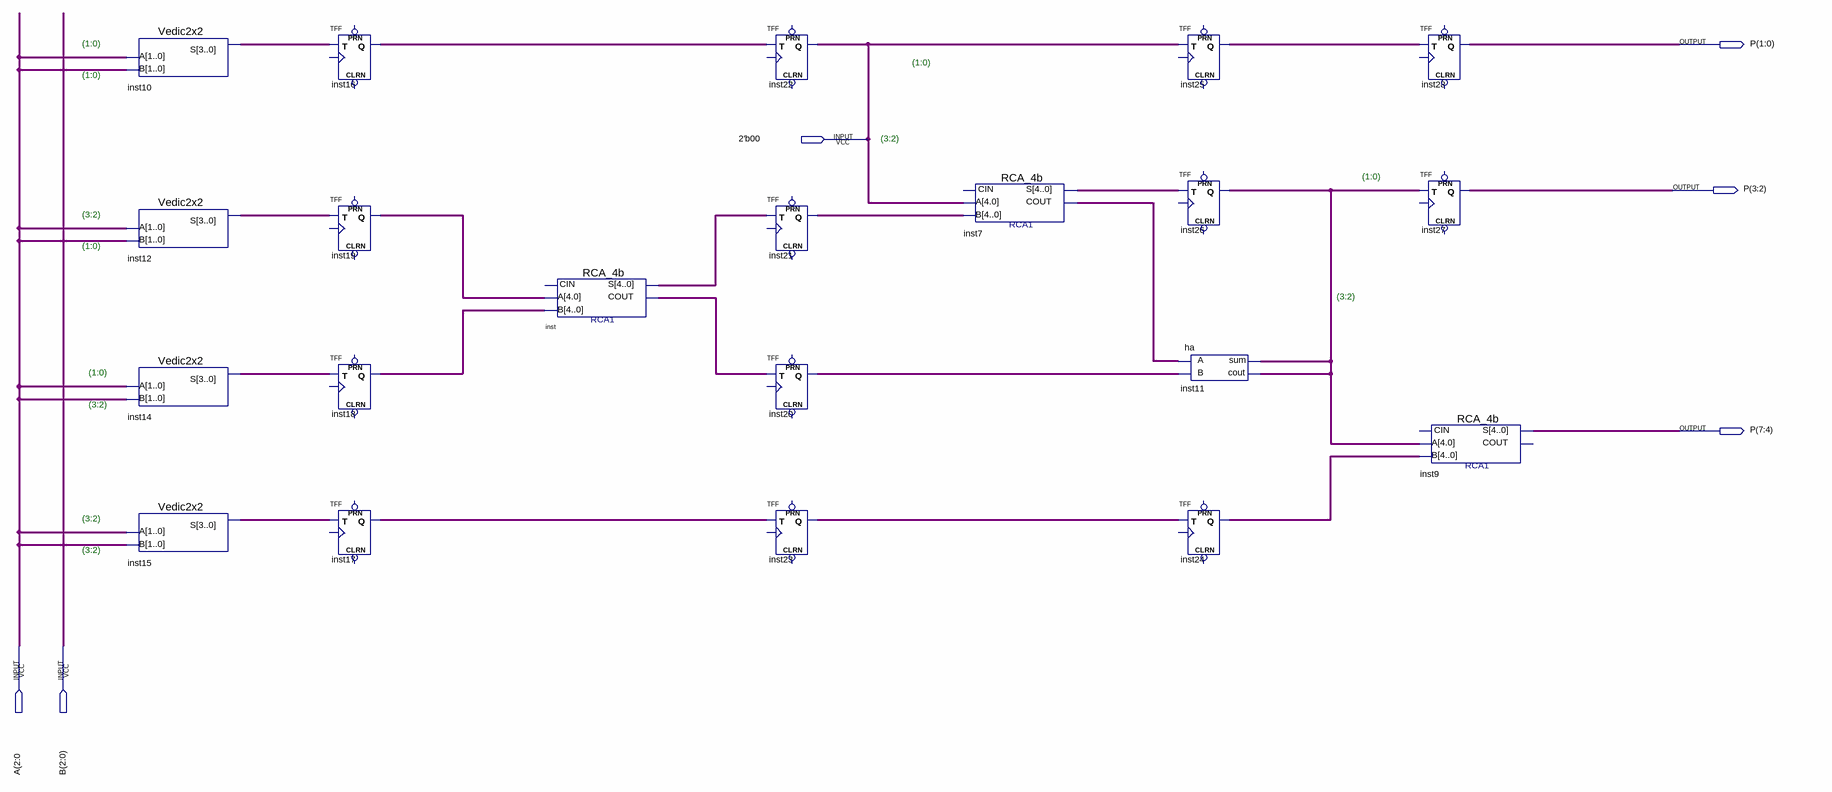
[diagram p0: schematic sheet]
// Quartus schematic shematic_4x4.bdf as structural Verilog: 21 symbols, 6 pins
module shematic_4x4 (
  input  \2'b00 ,
  input  \A(2:0 ,
  input  \B(2:0) ,
  output \P(1:0) ,
  output \P(3:2) ,
  output \P(7:4) 
);

  wire inst7_cout, inst20_q, inst_cout;
  wire [1:0] undriven;
  wire [3:0] inst10_sum, inst12_sum, inst16_q, inst19_q, inst22_q, inst25_q, inst28_q;
  wire [4:0] inst14_sum, inst15_sum, inst17_q, inst18_q, inst23_q, inst24_q;
  wire [7:0] inst7_sum, inst9_sum, inst21_q, inst26_q, inst27_q, inst_sum;

  Vedic2x2 inst10 (.A(undriven), .B(undriven), .SUM(inst10_sum));
  Vedic2x2 inst12 (.A(undriven), .B(undriven), .SUM(inst12_sum));
  Vedic2x2 inst14 (.A(undriven), .B(undriven), .SUM(inst14_sum));
  Vedic2x2 inst15 (.A(undriven), .B(undriven), .SUM(inst15_sum));
  TFF inst16[3:0] (.T(inst10_sum), .Q(inst16_q));  // open: PRN, CLRN, CLK
  TFF inst19[3:0] (.T(inst12_sum), .Q(inst19_q));  // open: PRN, CLRN, CLK
  TFF inst18[4:0] (.T(inst14_sum), .Q(inst18_q));  // open: PRN, CLRN, CLK
  TFF inst17[4:0] (.T(inst15_sum), .Q(inst17_q));  // open: PRN, CLRN, CLK
  RCA_4b inst (.\A[4.0] (inst19_q), .B(inst18_q), .COUT(inst_cout), .SUM(inst_sum));  // open: CIN
  TFF inst22[3:0] (.T(inst16_q), .Q(inst22_q));  // open: PRN, CLRN, CLK
  TFF inst21[7:0] (.T(inst_sum), .Q(inst21_q));  // open: PRN, CLRN, CLK
  TFF inst20 (.T(inst_cout), .Q(inst20_q));  // open: PRN, CLRN, CLK
  TFF inst23[4:0] (.T(inst17_q), .Q(inst23_q));  // open: PRN, CLRN, CLK
  RCA_4b inst7 (.\A[4.0] (inst22_q), .B(inst21_q), .COUT(inst7_cout), .SUM(inst7_sum));  // open: CIN
  TFF inst25[3:0] (.T(inst22_q), .Q(inst25_q));  // open: PRN, CLRN, CLK
  TFF inst26[7:0] (.T(inst7_sum), .Q(inst26_q));  // open: PRN, CLRN, CLK
  ha inst11 (.A(inst7_cout), .B(inst20_q), .cout(inst26_q), .sum(inst26_q));
  TFF inst24[4:0] (.T(inst23_q), .Q(inst24_q));  // open: PRN, CLRN, CLK
  TFF inst28[3:0] (.T(inst25_q), .Q(inst28_q));  // open: PRN, CLRN, CLK
  TFF inst27[7:0] (.T(inst26_q), .Q(inst27_q));  // open: PRN, CLRN, CLK
  RCA_4b inst9 (.\A[4.0] (inst26_q), .B(inst24_q), .SUM(inst9_sum));  // open: CIN, COUT

  // Notes on the sheet:
  //   (1:0)
  //   (1:0)
  //   (1:0)
  //   (3:2)
  //   (1:0)
  //   (3:2)
  //   (1:0)
  //   (3:2)
  //   (1:0)
  //   (3:2)
  //   (3:2)
  //   (3:2)
endmodule
